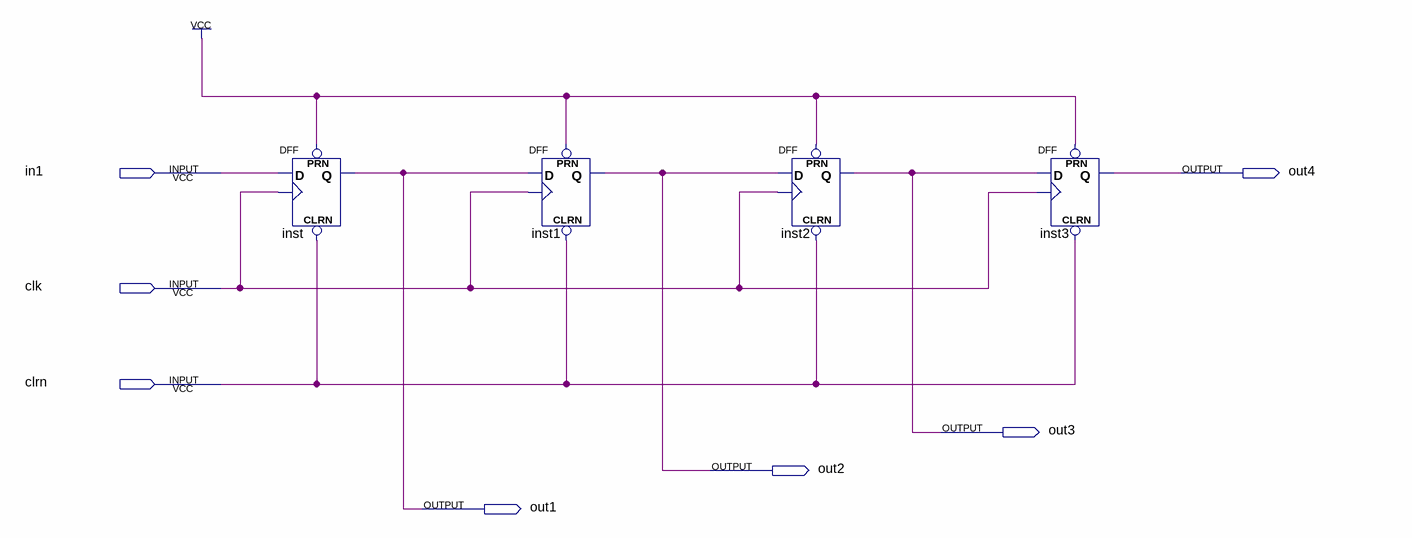
[diagram p0: schematic sheet]
// Quartus schematic ShiftRegisterSIPO_4bit.bdf as structural Verilog: 4 symbols, 7 pins
module ShiftRegisterSIPO_4bit (
  input  in1,
  input  clk,
  input  clrn,
  output out4,
  output out3,
  output out2,
  output out1
);

  DFF inst (.CLRN(clrn), .CLK(clk), .D(in1), .PRN(1'b1), .Q(out1));
  DFF inst1 (.CLRN(clrn), .CLK(clk), .D(out1), .PRN(1'b1), .Q(out2));
  DFF inst2 (.CLRN(clrn), .CLK(clk), .D(out2), .PRN(1'b1), .Q(out3));
  DFF inst3 (.CLRN(clrn), .CLK(clk), .D(out3), .PRN(1'b1), .Q(out4));
endmodule
